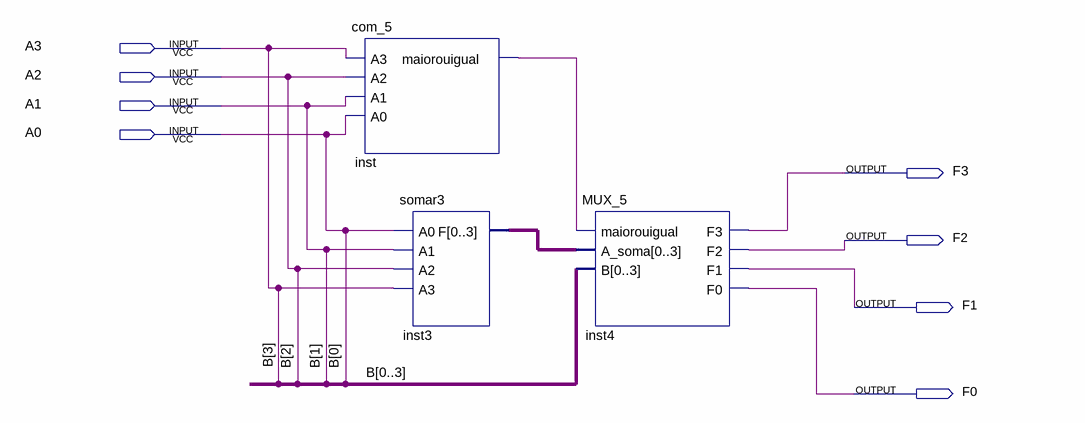
[diagram p0: schematic sheet]
// Quartus schematic dd.bdf as structural Verilog: 3 symbols, 8 pins
module dd (
  input  A3,
  input  A2,
  input  A1,
  input  A0,
  output F3,
  output F2,
  output F1,
  output F0
);

  wire inst_maiorouigual;
  wire [3:0] inst3_f;

  com_5 inst (.A3(A3), .A2(A2), .A1(A1), .A0(A0), .maiorouigual(inst_maiorouigual));
  somar3 inst3 (.A0(A0), .A1(A1), .A2(A2), .A3(A3), .F(inst3_f));
  MUX_5 inst4 (
    .maiorouigual(inst_maiorouigual), .A_soma(inst3_f), .B({A0, A1, A2, A3}), .F3(F3), .F2(F2), .F1(F1),
    .F0(F0));

  // Other names for the same wires on the sheet: B[3:0] = {A3, A2, A1, A0}
endmodule
